# Altium schematic sheet v1_control.SCHDOC
size A4
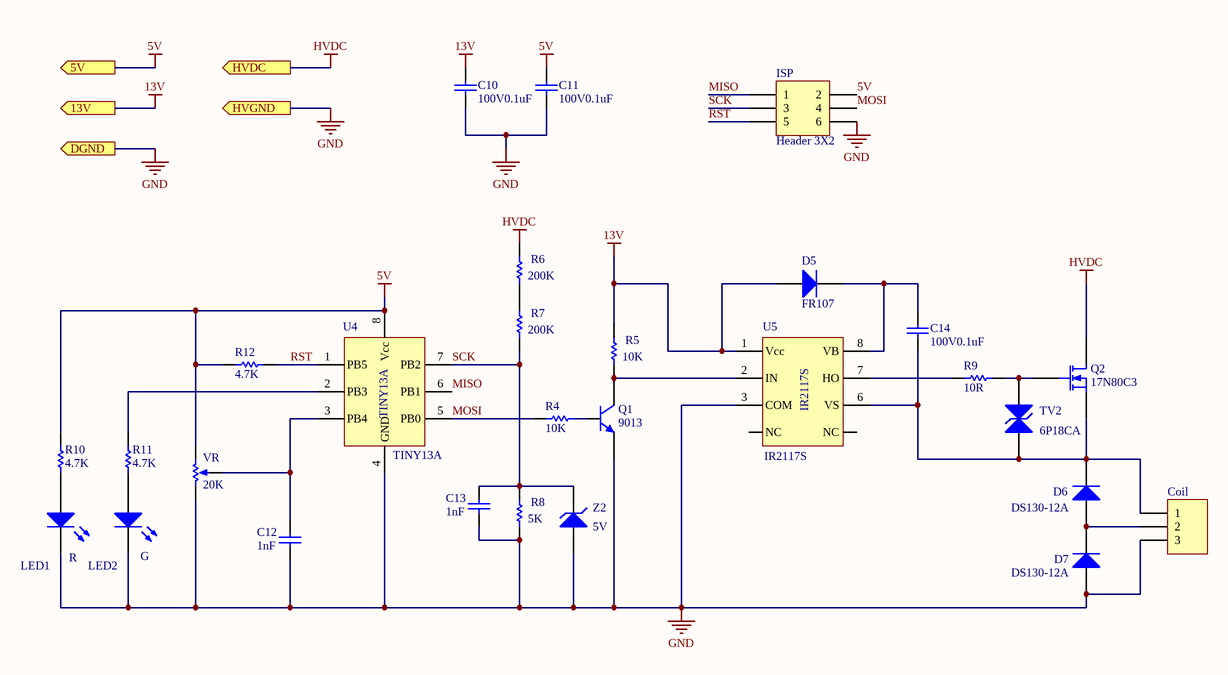
[diagram p0: v1_control.SCHDOC]

## Parts
C10  100V0.1uF  [CAP6]
C11  100V0.1uF  [CAP6]
C12  1nF  [CAP6]
C13  1nF  [CAP6]
C14  100V0.1uF  [CAP6]
Coil  Header 3  [Terminal3_1]  (value not drawn)
D5  FR107  [DIO1]
D6  DS130-12A  [TO-220_2]
D7  DS130-12A  [TO-220_2]
ISP  Header 3X2  [HDR2X3]
LED1  R  [LED1R]
LED2  G  [LED1G]
Q1  9013  [TO-92D]
Q2  17N80C3  [TO-247]
R4  10K  [RES0.25W]
R5  10K  [RES0.25W]
R6  200K  [RES0.25W]
R7  200K  [RES0.25W]
R8  5K  [RES0.25W]
R9  10R  [RES0.25W]
R10  4.7K  [RES0.25W]
R11  4.7K  [RES0.25W]
R12  4.7K  [RES0.25W]
TV2  6P18CA  [TVS2]
U4  TINY13A  [DIP-8]
U5  IR2117S  [DIP-8]
VR  value 20K  [3296W]  (hidden comment: RPot)
Z2  5V  [DIO2]

## Ports
5V, 13V, DGND, HVDC, HVGND

## Nets
5V: C11.1 ISP.2 R10.1 R12.1 U4.8(Vcc) VR.1 ; port 5V
13V: C10.1 D5.1(A) R5.1 U5.1(Vcc) ; port 13V
GND: C10.2 C11.2 C12.2 C13.2 Coil.3 D7.1(A) ISP.6 LED1.2(K) LED2.2(K) Q1.1(E) R8.2 U4.4(GND) U5.3(COM) VR.3 Z2.1(A) ; port HVGND, port DGND
HVDC: Q2.2(D) R6.1 ; port HVDC
MISO: ISP.1 U4.6(PB1)
MOSI: ISP.4 R4.2 U4.5(PB0)
RST: ISP.5 R12.2 U4.1(PB5)
SCK: C13.1 ISP.3 R7.2 R8.1 U4.7(PB2) Z2.2(K)
NetC12_1: C12.1 U4.3(PB4) VR.2
NetC14_1: C14.1 D5.2(K) U5.8(VB)
NetC14_2: C14.2 Coil.1 D6.2(K) Q2.3(S) TV2.1(A) U5.6(VS)
NetCoil_2: Coil.2 D6.1(A) D7.2(K)
NetLED1_1: LED1.1(A) R10.2
NetLED2_1: LED2.1(A) R11.2
NetQ1_2: Q1.2(B) R4.1
NetQ1_3: Q1.3(C) R5.2 U5.2(IN)
NetQ2_1: Q2.1(G) R9.2 TV2.2(K)
NetR6_2: R6.2 R7.1
NetR9_1: R9.1 U5.7(HO)
NetR11_1: R11.1 U4.2(PB3)

Not connected (* = marked no-connect by the designer): U5 4(NC) 5(NC)

## Library data of the parts
C10-C14 = Cap: Capacitor; Published: 8-Jun-2000; LatestRevisionDate: 17-Jul-2002; LatestRevisionNote: Re-released for DXP Platform.; Publisher: Altium Limited
Coil = Header 3: Header, 3-Pin; LatestRevisionDate: 17-Jul-2002; LatestRevisionNote: Re-released for DXP Platform.; Publisher: Altium Limited
D5 = Diode: 1 Amp Fast Recovery Rectifier; Published: 8-Jun-2000; LatestRevisionDate: 17-Jul-2002; LatestRevisionNote: Re-released for DXP Platform.; PackageReference: DO-41; Publisher: Altium Limited; Code_JEDEC: DO-204-AL; DatasheetDocument: 1999; PackageDocument: Aug-1999; ComponentLink1Description: Manufacturer Link; ComponentLink1URL: http://www.fairchildsemi.com/
D6 D7 = Diode: Published: 8-Jun-2000; LatestRevisionDate: 17-Jul-2002; LatestRevisionNote: Re-released for DXP Platform.; DatasheetDocument: 1999; PackageDocument: Aug-1999; PackageReference: DO-41; Publisher: Altium Limited; ComponentLink1Description: Manufacturer Link; ComponentLink1URL: http://www.fairchildsemi.com/; Code_JEDEC: DO-204-AL
ISP = Header 3X2: Header, 3-Pin, Dual row; LatestRevisionDate: 17-Jul-2002; LatestRevisionNote: Re-released for DXP Platform.; Publisher: Altium Limited
LED1 LED2 = LED: Published: 8-Jun-2000; LatestRevisionDate: 08-Jul-2005; LatestRevisionNote: Mech Layer 1 removed.; PackageReference: LED-0; Publisher: Altium Limited; PackageDescription: LED; 2 Leads
Q1 = 9013: NPN Bipolar Transistor; Published: 8-Jun-2000; LatestRevisionDate: 17-Jul-2002; LatestRevisionNote: Re-released for DXP Platform.; PackageReference: TO-226-AA; Publisher: Altium Limited; PackageDescription: TO, Flat Index; 3 In-Line, Axial Leads; Body Dia. 4.8mm; Leads 0.55 x 0.51 mm (max); Code_JEDEC: TO-226-AA
Q2 = 17N80C3: MOSFET N; Published: 8-Jun-2000; LatestRevisionDate: 17-Jul-2002; LatestRevisionNote: Re-released for DXP Platform.; PackageVersion: 1995/1996; PackageReference: E3; Publisher: Altium Limited; PackageDescription: TO, Flat Index; 3 In-Line, Axial Leads; Body Dia. 4.6mm; Lead Dia. 0.5 mm (max)
R4-R12 = Res1: Resistor; Published: 8-Jun-2000; LatestRevisionDate: 17-Jul-2002; LatestRevisionNote: Re-released for DXP Platform.; Publisher: Altium Limited
TV2 = TVS: TVS Diode; Published: 8-Jun-2000; LatestRevisionDate: 17-Jul-2002; LatestRevisionNote: Re-released for DXP Platform.; Publisher: Altium Limited
U4 = TINY13A: AVR MCU
U5 = IR2117S: MOSFET Driver
VR = RPot: Potentiometer; Sim Note: Enter the Resistance value and the set point into parameter fields.; Set Position: 0.5; Published: 8-Jun-2000; LatestRevisionDate: 17-Jul-2002; LatestRevisionNote: Re-released for DXP Platform.; PackageReference: VR5; Publisher: Altium Limited; PackageDescription: Variable Resistor, Thru-Hole; 3 Leads
Z2 = D Zener: Zener Diode; Published: 8-Jun-2000; LatestRevisionDate: 17-Jul-2002; LatestRevisionNote: Re-released for DXP Platform.; Publisher: Altium Limited